# EAGLE schematic FPGA_APU V3 (EAGLE 9.6.2)
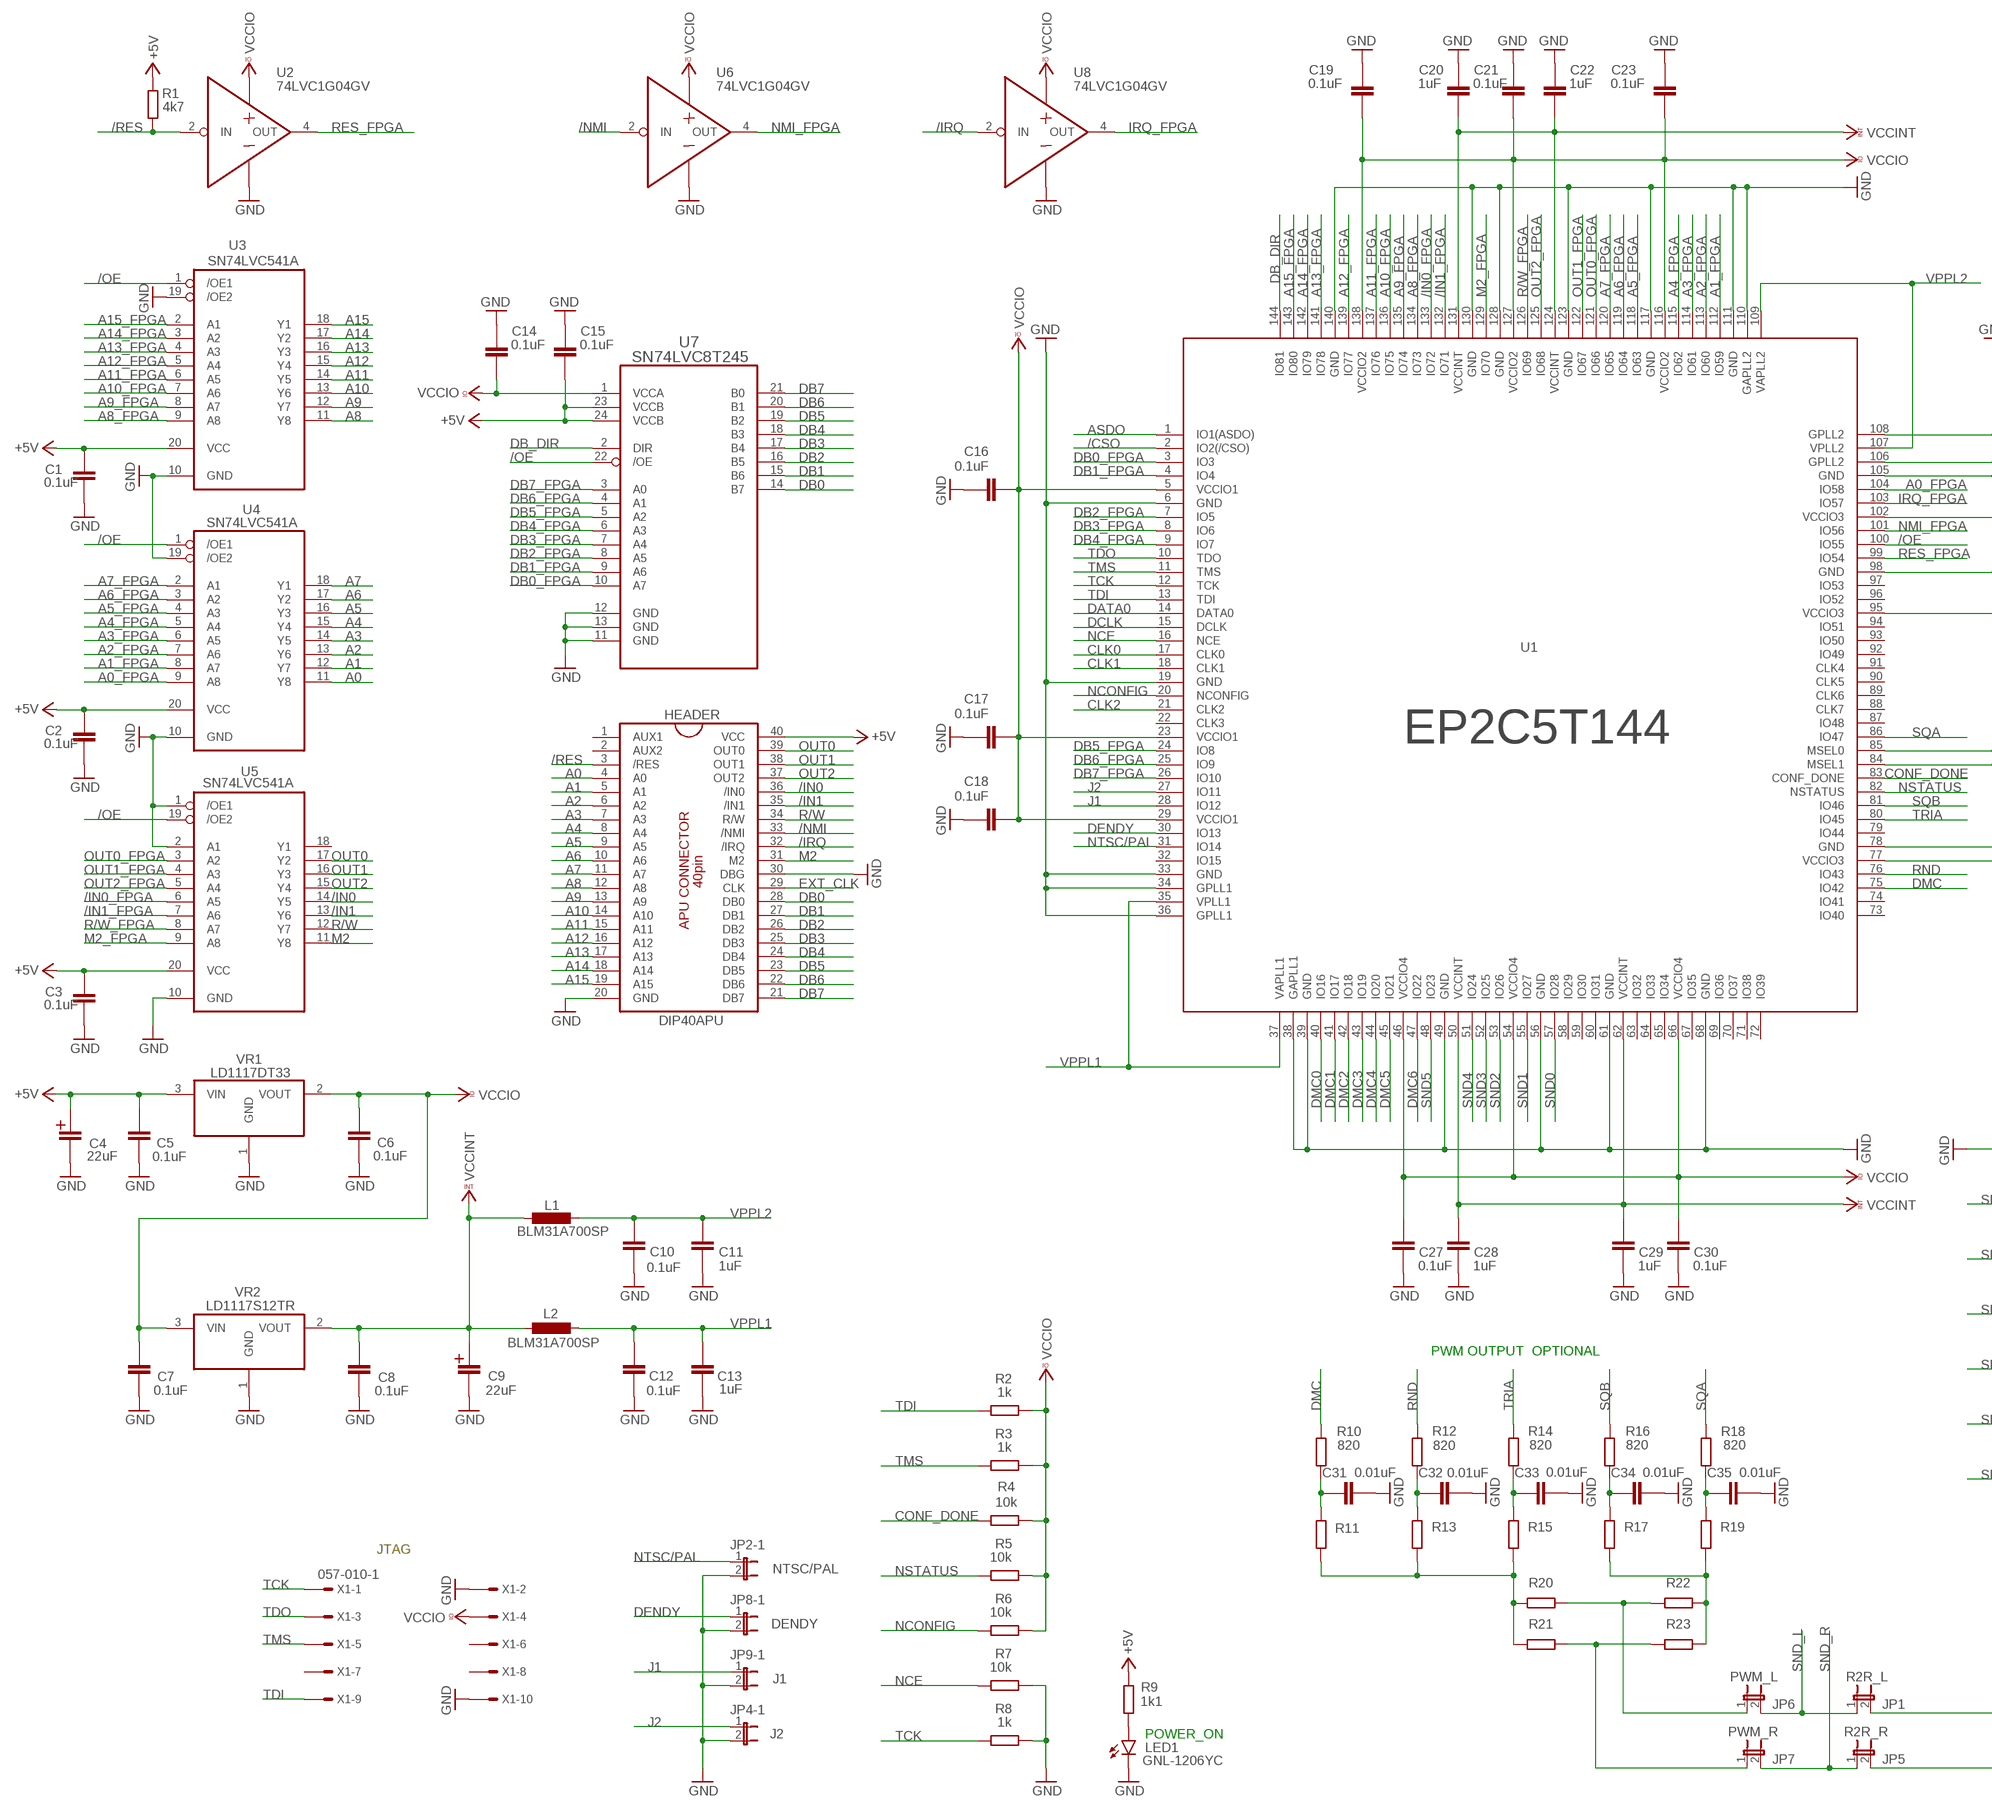
[diagram p0: schematic, sheet 1, part 1 of 2]
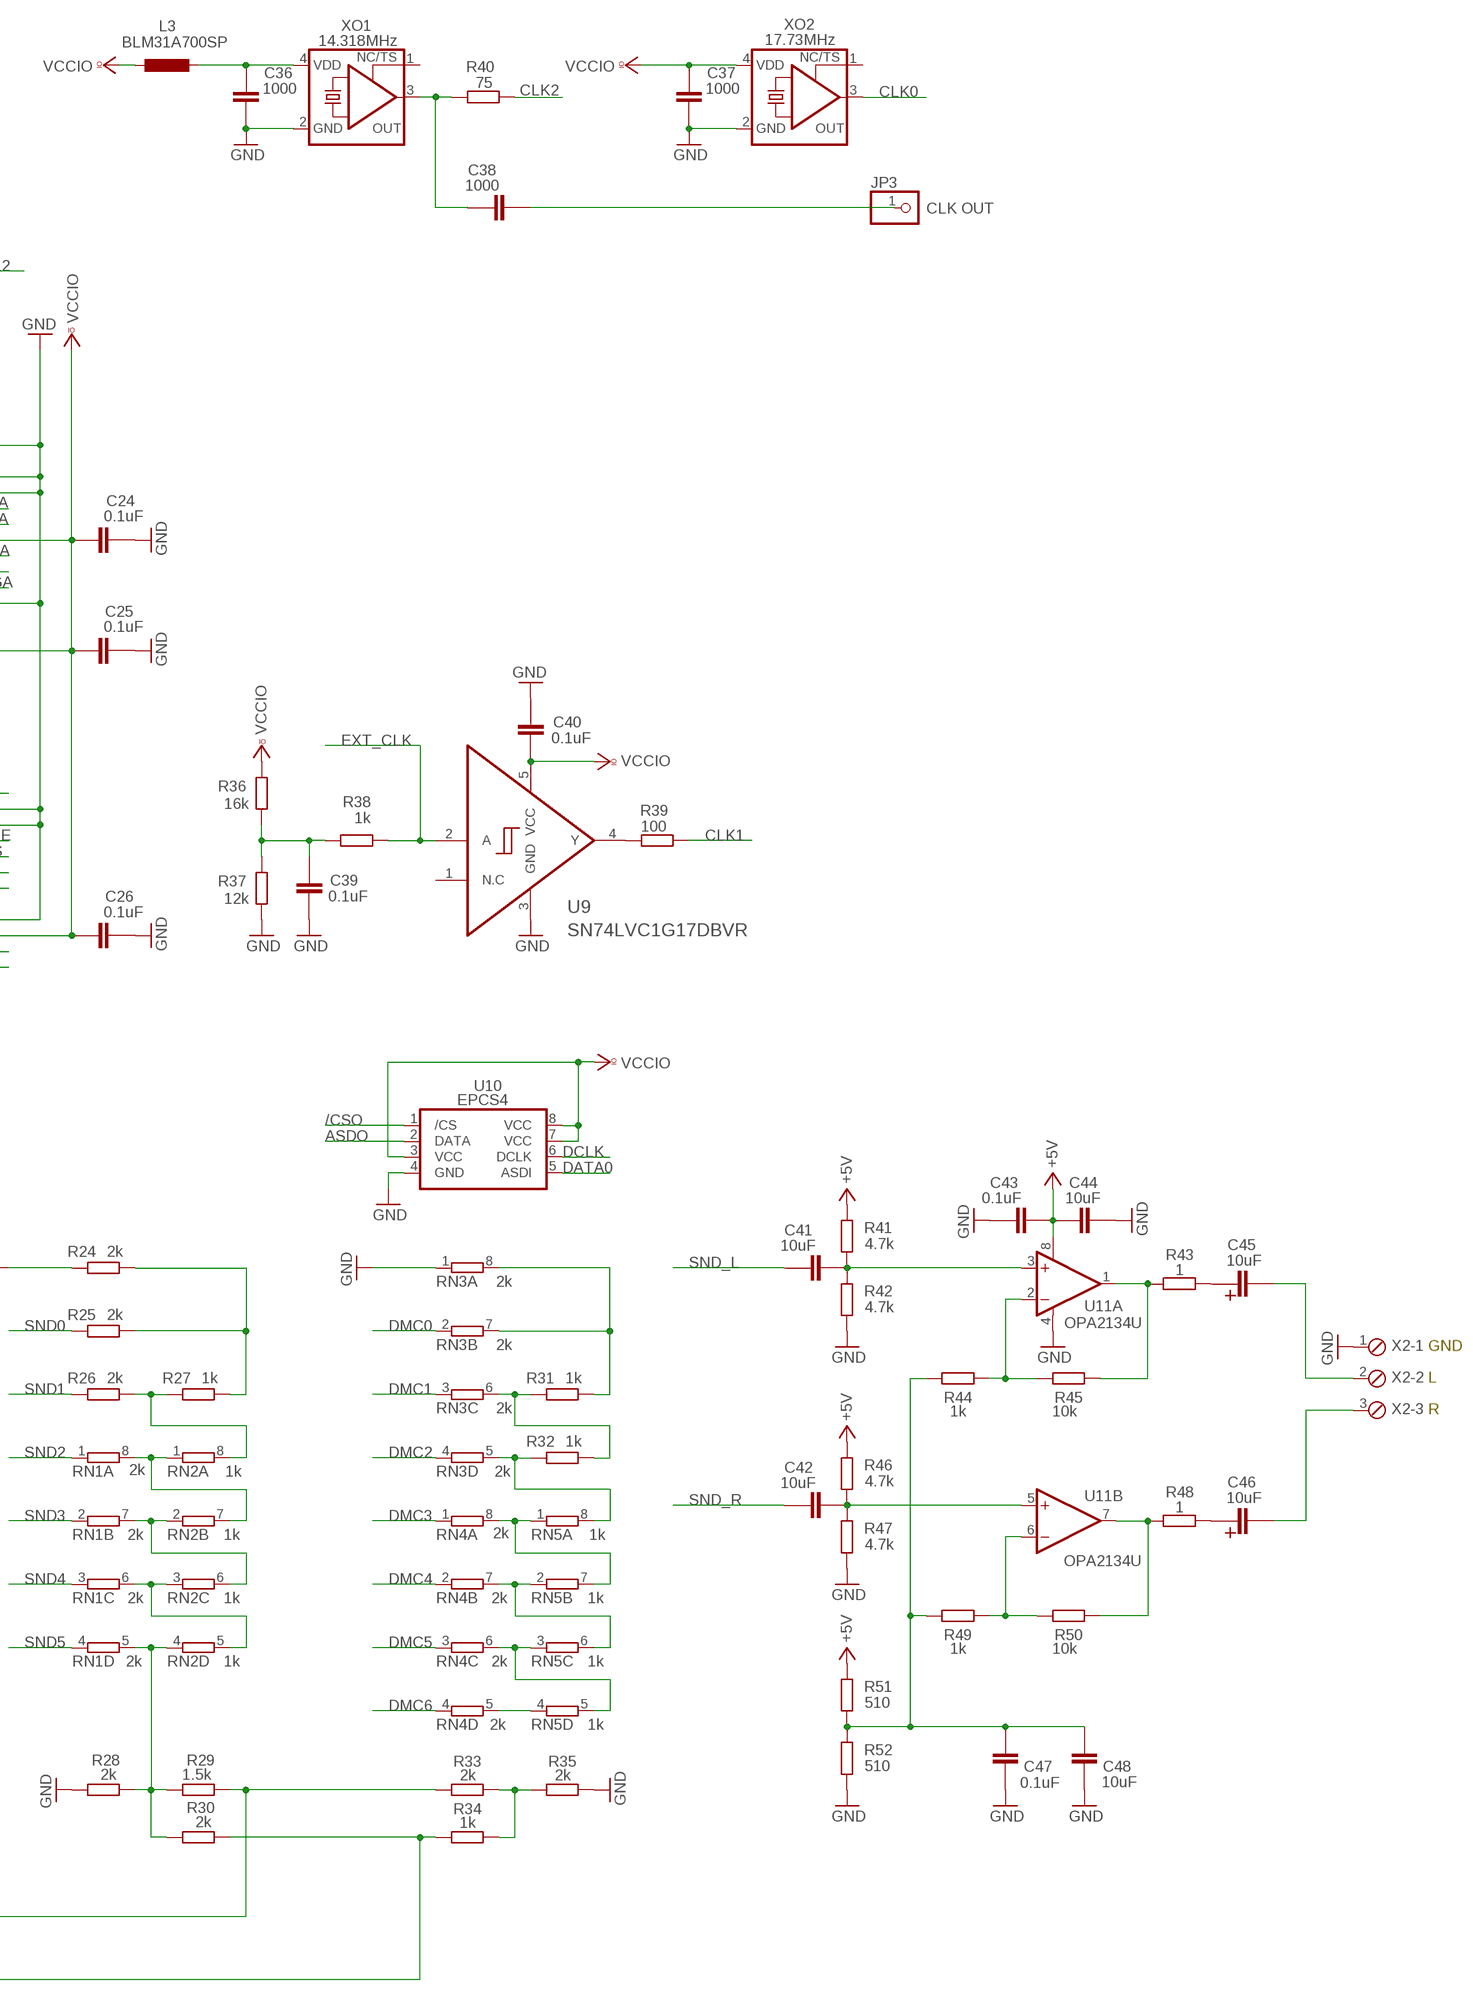
[diagram p1: schematic, sheet 1, part 2 of 2]

## Parts
C1  0.1uF  C-EUC0805  [C0805]
C2  0.1uF  C-EUC0805  [C0805]
C3  0.1uF  C-EUC0805  [C0805]
C4  22uF  CPOL-EU153CLV-0505  [153CLV-0505]
C5  0.1uF  C-EUC0805  [C0805]
C6  0.1uF  C-EUC0805  [C0805]
C7  0.1uF  C-EUC0805  [C0805]
C8  0.1uF  C-EUC0805  [C0805]
C9  22uF  CPOL-EU153CLV-0505  [153CLV-0505]
C10  0.1uF  C-EUC0805  [C0805]
C11  1uF  C-EUC0805  [C0805]
C12  0.1uF  C-EUC0805  [C0805]
C13  1uF  C-EUC0805  [C0805]
C14  0.1uF  C-EUC0805  [C0805]
C15  0.1uF  C-EUC0805  [C0805]
C16  0.1uF  C-EUC0805  [C0805]
C17  0.1uF  C-EUC0805  [C0805]
C18  0.1uF  C-EUC0805  [C0805]
C19  0.1uF  C-EUC0805  [C0805]
C20  1uF  C-EUC0805  [C0805]
C21  0.1uF  C-EUC0805  [C0805]
C22  1uF  C-EUC0805  [C0805]
C23  0.1uF  C-EUC0805  [C0805]
C24  0.1uF  C-EUC0805  [C0805]
C25  0.1uF  C-EUC0805  [C0805]
C26  0.1uF  C-EUC0805  [C0805]
C27  0.1uF  C-EUC0805  [C0805]
C28  1uF  C-EUC0805  [C0805]
C29  1uF  C-EUC0805  [C0805]
C30  0.1uF  C-EUC0805  [C0805]
C31  0.01uF  C-EUC0805  [C0805]
C32  0.01uF  C-EUC0805  [C0805]
C33  0.01uF  C-EUC0805  [C0805]
C34  0.01uF  C-EUC0805  [C0805]
C35  0.01uF  C-EUC0805  [C0805]
C36  1000  C-EUC0805  [C0805]
C37  1000  C-EUC0805  [C0805]
C38  1000  C-EUC0805  [C0805]
C39  0.1uF  C-EUC0603  [C0603]
C40  0.1uF  C-EUC0603  [C0603]
C41  10uF  C-EUC0805  [C0805]
C42  10uF  C-EUC0805  [C0805]
C43  0.1uF  C-EUC0805  [C0805]
C44  10uF  C-EUC0805  [C0805]
C45  10uF  CPOL-EU153CLV-0505  [153CLV-0505]
C46  10uF  CPOL-EU153CLV-0505  [153CLV-0505]
C47  0.1uF  C-EUC0805  [C0805]
C48  10uF  C-EUC0805  [C0805]
HEADER  DIP40APU  [DIP-40]
JP1  R2R_L  JP1E  [JP1]
JP2  NTSC/PAL  JP4QE  [JP4Q]
JP3  CLK OUT  PINHD-1X1  [1X01]
JP4  J2  JP4QE  [JP4Q]
JP5  R2R_R  JP1E  [JP1]
JP6  PWM_L  JP1E  [JP1]
JP7  PWM_R  JP1E  [JP1]
JP8  DENDY  JP4QE  [JP4Q]
JP9  J1  JP4QE  [JP4Q]
L1  BLM31A700SP  L-EUL2012C  [L2012C]
L2  BLM31A700SP  L-EUL2012C  [L2012C]
L3  BLM31A700SP  L-EUL2012C  [L2012C]
LED1  GNL-1206YC  LED  [SMARTLED-TTW]
R1  4k7  R-EU_R0805  [R0805]
R2  1k  R-EU_R0805  [R0805]
R3  1k  R-EU_R0805  [R0805]
R4  10k  R-EU_R0805  [R0805]
R5  10k  R-EU_R0805  [R0805]
R6  10k  R-EU_R0805  [R0805]
R7  10k  R-EU_R0805  [R0805]
R8  1k  R-EU_R0805  [R0805]
R9  1k1  R-EU_R0805  [R0805]
R10  820  R-EU_R0805  [R0805]
R11  R-EU_R0805  [R0805]
R12  820  R-EU_R0805  [R0805]
R13  R-EU_R0805  [R0805]
R14  820  R-EU_R0805  [R0805]
R15  R-EU_R0805  [R0805]
R16  820  R-EU_R0805  [R0805]
R17  R-EU_R0805  [R0805]
R18  820  R-EU_R0805  [R0805]
R19  R-EU_R0805  [R0805]
R20  R-EU_R0805  [R0805]
R21  R-EU_R0805  [R0805]
R22  R-EU_R0805  [R0805]
R23  R-EU_R0805  [R0805]
R24  2k  R-EU_R0805  [R0805]
R25  2k  R-EU_R0805  [R0805]
R26  2k  R-EU_R0805  [R0805]
R27  1k  R-EU_R0805  [R0805]
R28  2k  R-EU_R0805  [R0805]
R29  1.5k  R-EU_R0805  [R0805]
R30  2k  R-EU_R0805  [R0805]
R31  1k  R-EU_R0805  [R0805]
R32  1k  R-EU_R0805  [R0805]
R33  2k  R-EU_R0805  [R0805]
R34  1k  R-EU_R0805  [R0805]
R35  2k  R-EU_R0805  [R0805]
R36  16k  R-EU_R0805  [R0805]
R37  12k  R-EU_R0805  [R0805]
R38  1k  R-EU_R0805  [R0805]
R39  100  R-EU_R0805  [R0805]
R40  75  R-EU_R0805  [R0805]
R41  4.7k  R-EU_R0805  [R0805]
R42  4.7k  R-EU_R0805  [R0805]
R43  1  R-EU_R0805  [R0805]
R44  1k  R-EU_R0805  [R0805]
R45  10k  R-EU_R0805  [R0805]
R46  4.7k  R-EU_R0805  [R0805]
R47  4.7k  R-EU_R0805  [R0805]
R48  1  R-EU_R0805  [R0805]
R49  1k  R-EU_R0805  [R0805]
R50  10k  R-EU_R0805  [R0805]
R51  510  R-EU_R0805  [R0805]
R52  510  R-EU_R0805  [R0805]
RN1  2k  4R-N0603-ARC  [0603-ARC]
RN2  1k  4R-N0603-ARC  [0603-ARC]
RN3  2k  4R-N0603-ARC  [0603-ARC]
RN4  2k  4R-N0603-ARC  [0603-ARC]
RN5  1k  4R-N0603-ARC  [0603-ARC]
U1  EP2C5T144  [TQFP144]
U2  74LVC1G04GV  [SOT95P275X110-5N]
U3  SN74LVC541A  [TSOP20]
U4  SN74LVC541A  [TSOP20]
U5  SN74LVC541A  [TSOP20]
U6  74LVC1G04GV  [SOT95P275X110-5N]
U7  SN74LVC8T245  [SOP65P640X110-24N]
U8  74LVC1G04GV  [SOT95P275X110-5N]
U9  SN74LVC1G17DBVR  [SOT95P280X145-5N]
U10  EPCS4  [SO08]
U11  OPA2134U  [SO08]
VR1  LD1117DT33  [DPAK456P1010X240-3N]
VR2  LD1117S12TR  [SOT-223-3]
X1  057-010-1  [057-010-1]
X2  OUT  MPT7  [7POL254]
XO1  14.318MHz  KXO-PXO/XO-V97  [7.0X5.08_KXO-(V)97]
XO2  17.73MHz  KXO-PXO/XO-V95  [2.5X2.0_KXO-V95]

## Nets
+5V: C1.1 C2.1 C3.1 C4.+ C5.1 C15.2 C43.2 C44.1 HEADER.40(VCC) R1.1 R9.2 R41.1 R46.1 R51.1 U3.20(VCC) U4.20(VCC) U5.20(VCC) U7.23(VCCB) U7.24(VCCB) U11.8(A:V+) VR1.3(VIN)
/CSO: U1.2(IO2(/CSO)) U10.1(/CS)
/IN0: HEADER.36(/IN0) U5.14(Y5)
/IN0_FPGA: U1.133(IO72) U5.6(A5)
/IN1: HEADER.35(/IN1) U5.13(Y6)
/IN1_FPGA: U1.132(IO71) U5.7(A6)
/IRQ: HEADER.32(/IRQ) U8.2(IN)
/NMI: HEADER.33(/NMI) U6.2(IN)
/OE: U1.100(IO55) U3.1(/OE1) U4.1(/OE1) U5.19(/OE2) U7.22(/OE)
/RES: HEADER.3(/RES) R1.2 U2.2(IN)
A0: HEADER.4(A0) U4.11(Y8)
A0_FPGA: U1.104(IO58) U4.9(A8)
A1: HEADER.5(A1) U4.12(Y7)
A1_FPGA: U1.112(IO59) U4.8(A7)
A2: HEADER.6(A2) U4.13(Y6)
A2_FPGA: U1.113(IO60) U4.7(A6)
A3: HEADER.7(A3) U4.14(Y5)
A3_FPGA: U1.114(IO61) U4.6(A5)
A4: HEADER.8(A4) U4.15(Y4)
A4_FPGA: U1.115(IO62) U4.5(A4)
A5: HEADER.9(A5) U4.16(Y3)
A5_FPGA: U1.118(IO63) U4.4(A3)
A6: HEADER.10(A6) U4.17(Y2)
A6_FPGA: U1.119(IO64) U4.3(A2)
A7: HEADER.11(A7) U4.18(Y1)
A7_FPGA: U1.120(IO65) U4.2(A1)
A8: HEADER.12(A8) U3.11(Y8)
A8_FPGA: U1.134(IO73) U3.9(A8)
A9: HEADER.13(A9) U3.12(Y7)
A9_FPGA: U1.135(IO74) U3.8(A7)
A10: HEADER.14(A10) U3.13(Y6)
A10_FPGA: U1.136(IO75) U3.7(A6)
A11: HEADER.15(A11) U3.14(Y5)
A11_FPGA: U1.137(IO76) U3.6(A5)
A12: HEADER.16(A12) U3.15(Y4)
A12_FPGA: U1.139(IO77) U3.5(A4)
A13: HEADER.17(A13) U3.16(Y3)
A13_FPGA: U1.141(IO78) U3.4(A3)
A14: HEADER.18(A14) U3.17(Y2)
A14_FPGA: U1.142(IO79) U3.3(A2)
A15: HEADER.19(A15) U3.18(Y1)
A15_FPGA: U1.143(IO80) U3.2(A1)
ASDO: U1.1(IO1(ASDO)) U10.2(DATA)
CLK0: U1.17(CLK0) XO2.3(OUT)
CLK1: R39.2 U1.18(CLK1)
CLK2: R40.2 U1.21(CLK2)
CONF_DONE: R4.2 U1.83(CONF_DONE)
DATA0: U1.14(DATA0) U10.5(ASDI)
DB0: HEADER.28(DB0) U7.14(B7)
DB0_FPGA: U1.3(IO3) U7.10(A7)
DB1: HEADER.27(DB1) U7.15(B6)
DB1_FPGA: U1.4(IO4) U7.9(A6)
DB2: HEADER.26(DB2) U7.16(B5)
DB2_FPGA: U1.7(IO5) U7.8(A5)
DB3: HEADER.25(DB3) U7.17(B4)
DB3_FPGA: U1.8(IO6) U7.7(A4)
DB4: HEADER.24(DB4) U7.18(B3)
DB4_FPGA: U1.9(IO7) U7.6(A3)
DB5: HEADER.23(DB5) U7.19(B2)
DB5_FPGA: U1.24(IO8) U7.5(A2)
DB6: HEADER.22(DB6) U7.20(B1)
DB6_FPGA: U1.25(IO9) U7.4(A1)
DB7: HEADER.21(DB7) U7.21(B0)
DB7_FPGA: U1.26(IO10) U7.3(A0)
DB_DIR: U1.144(IO81) U7.2(DIR)
DCLK: U1.15(DCLK) U10.6(DCLK)
DENDY: JP8.1 U1.30(IO13)
DMC: R10.1 U1.75(IO42)
DMC0: RN3.2 U1.40(IO16)
DMC1: RN3.3 U1.41(IO17)
DMC2: RN3.4 U1.42(IO18)
DMC3: RN4.1 U1.43(IO19)
DMC4: RN4.2 U1.44(IO20)
DMC5: RN4.3 U1.45(IO21)
DMC6: RN4.4 U1.47(IO22)
EXT_CLK: HEADER.29(CLK) R38.1 U9.2(A)
GND: C1.2 C2.2 C3.2 C4.- C5.2 C6.2 C7.2 C8.2 C9.- C10.2 C11.2 C12.2 C13.2 C14.1 C15.1 C16.1 C17.1 C18.1 C19.1 C20.1 C21.1 C22.1 C23.1 C24.2 C25.2 C26.2 C27.2 C28.2 C29.2 C30.2 C31.2 C32.2 C33.2 C34.2 C35.2 C36.2 C37.2 C39.1 C40.2 C43.1 C44.2 C47.2 C48.2 HEADER.20(GND) HEADER.30(DBG) JP2.2 JP4.2 JP8.2 JP9.2 LED1.C@1(C) R7.2 R8.2 R24.1 R28.1 R35.2 R37.1 R42.2 R47.2 R52.2 RN3.1 U1.6(GND) U1.19(GND) U1.33(GND) U1.34(GPLL1) U1.36(GPLL1) U1.38(GAPLL1) U1.39(GND) U1.49(GND) U1.56(GND) U1.61(GND) U1.68(GND) U1.78(GND) U1.84(MSEL1) U1.85(MSEL0) U1.98(GND) U1.105(GND) U1.106(GPLL2) U1.108(GPLL2) U1.110(GAPLL2) U1.111(GND) U1.117(GND) U1.123(GND) U1.128(GND) U1.130(GND) U1.140(GND) U2.3(GND) U3.10(GND) U3.19(/OE2) U4.10(GND) U4.19(/OE2) U5.1(/OE1) U5.2(A1) U5.10(GND) U6.3(GND) U7.11(GND) U7.12(GND) U7.13(GND) U8.3(GND) U9.3(GND) U10.4(GND) U11.4(A:V-) VR1.1(GND) VR2.1(GND) X1.2 X1.10 X2.1 XO1.2(GND) XO2.2(GND)
IRQ_FPGA: U1.103(IO57) U8.4(OUT)
J1: JP9.1 U1.28(IO12)
J2: JP4.1 U1.27(IO11)
M2: HEADER.31(M2) U5.11(Y8)
M2_FPGA: U1.129(IO70) U5.9(A8)
N$1: RN4.5 RN5.4
N$2: C38.2 JP3.1
N$3: R28.2 R29.1 R30.1 RN1.5 RN2.4
N$4: C45.- X2.2
N$5: LED1.A@1(A) R9.1
N$6: C38.1 R40.1 XO1.3(OUT)
N$8: R49.2 R50.1 U11.6(B:-IN)
N$11: C46.- X2.3
N$17: RN1.8 RN2.1 RN2.7
N$18: R26.2 R27.1 RN2.8
N$19: R33.2 R34.2 R35.1
N$23: RN1.7 RN2.2 RN2.6
N$24: C36.1 L3.2 XO1.4(VDD)
N$25: RN1.6 RN2.3 RN2.5
N$27: R24.2 R25.2 R27.2
N$28: JP1.2 R29.2 R33.1
N$29: JP5.2 R30.2 R34.1
N$32: C31.1 R10.2 R11.1
N$33: R11.2 R13.2 R15.2 R20.1 R21.1
N$34: C32.1 R12.2 R13.1
N$35: R17.2 R19.2 R22.2 R23.2
N$36: C33.1 R14.2 R15.1
N$37: C45.+ R43.2
N$38: C34.1 R16.2 R17.1
N$39: JP6.1 R20.2 R22.1
N$40: C35.1 R18.2 R19.1
N$41: JP7.1 R21.2 R23.1
N$42: R44.2 R45.1 U11.2(A:-IN)
N$43: R43.1 R45.2 U11.1(A:OUT)
N$44: R48.1 R50.2 U11.7(B:OUT)
N$46: C41.2 R41.2 R42.1 U11.3(A:+IN)
N$47: C42.2 R46.2 R47.1 U11.5(B:+IN)
N$48: C46.+ R48.2
N$49: C39.2 R36.1 R37.2 R38.2
N$50: R39.1 U9.4(Y)
N$52: RN4.8 RN5.1 RN5.7
N$53: R32.1 RN3.5 RN5.8
N$54: RN4.7 RN5.2 RN5.6
N$55: RN4.6 RN5.3 RN5.5
N$56: R31.2 RN3.7 RN3.8
N$57: R31.1 R32.2 RN3.6
NCE: R7.1 U1.16(NCE)
NCONFIG: R6.1 U1.20(NCONFIG)
NMI_FPGA: U1.101(IO56) U6.4(OUT)
NSTATUS: R5.1 U1.82(NSTATUS)
NTSC/PAL: JP2.1 U1.31(IO14)
OUT0: HEADER.39(OUT0) U5.17(Y2)
OUT0_FPGA: U1.121(IO66) U5.3(A2)
OUT1: HEADER.38(OUT1) U5.16(Y3)
OUT1_FPGA: U1.122(IO67) U5.4(A3)
OUT2: HEADER.37(OUT2) U5.15(Y4)
OUT2_FPGA: U1.125(IO68) U5.5(A4)
R/W: HEADER.34(R/W) U5.12(Y7)
R/W_FPGA: U1.126(IO69) U5.8(A7)
RES_FPGA: U1.99(IO54) U2.4(OUT)
RND: R12.1 U1.76(IO43)
SND0: R25.1 U1.57(IO28)
SND1: R26.1 U1.55(IO27)
SND2: RN1.1 U1.53(IO26)
SND3: RN1.2 U1.52(IO25)
SND4: RN1.3 U1.51(IO24)
SND5: RN1.4 U1.48(IO23)
SND_L: C41.1 JP1.1 JP6.2
SND_R: C42.1 JP5.1 JP7.2
SQA: R18.1 U1.86(IO47)
SQB: R16.1 U1.81(IO46)
TCK: R8.1 U1.12(TCK) X1.1
TDI: R2.1 U1.13(TDI) X1.9
TDO: U1.10(TDO) X1.3
TMS: R3.1 U1.11(TMS) X1.5
TRIA: R14.1 U1.80(IO45)
VCCINT: C8.1 C9.+ C20.2 C22.2 C28.1 C29.1 L1.2 L2.1 U1.50(VCCINT) U1.62(VCCINT) U1.124(VCCINT) U1.131(VCCINT) VR2.2(VOUT)
VCCIO: C6.1 C7.1 C14.2 C16.2 C17.2 C18.2 C19.2 C21.2 C23.2 C24.1 C25.1 C26.1 C27.1 C30.1 C37.1 C40.1 L3.1 R2.2 R3.2 R4.1 R5.2 R6.2 R36.2 U1.5(VCCIO1) U1.23(VCCIO1) U1.29(VCCIO1) U1.46(VCCIO4) U1.54(VCCIO4) U1.66(VCCIO4) U1.77(VCCIO3) U1.95(VCCIO3) U1.102(VCCIO3) U1.116(VCCIO2) U1.127(VCCIO2) U1.138(VCCIO2) U2.5(VCC) U6.5(VCC) U7.1(VCCA) U8.5(VCC) U9.5(VCC) U10.3(VCC) U10.7(VCC) U10.8(VCC) VR1.2(VOUT) VR2.3(VIN) X1.4 XO2.4(VDD)
VPPL1: C12.1 C13.1 L2.2 U1.35(VPLL1) U1.37(VAPLL1)
VPPL2: C10.1 C11.1 L1.1 U1.107(VPLL2) U1.109(VAPLL2)
VPPL3: C47.1 C48.1 R44.1 R49.1 R51.2 R52.1
Unconnected: HEADER.1(AUX1) HEADER.2(AUX2) JP2.3 JP2.4 JP2.5 JP2.6 JP2.7 JP2.8 JP4.3 JP4.4 JP4.5 JP4.6 JP4.7 JP4.8 JP8.3 JP8.4 JP8.5 JP8.6 JP8.7 JP8.8 JP9.3 JP9.4 JP9.5 JP9.6 JP9.7 JP9.8 U1.22(CLK3) U1.32(IO15) U1.58(IO29) U1.59(IO30) U1.60(IO31) U1.63(IO32) U1.64(IO33) U1.65(IO34) U1.67(IO35) U1.69(IO36) U1.70(IO37) U1.71(IO38) U1.72(IO39) U1.73(IO40) U1.74(IO41) U1.79(IO44) U1.87(IO48) U1.88(CLK7) U1.89(CLK6) U1.90(CLK5) U1.91(CLK4) U1.92(IO49) U1.93(IO50) U1.94(IO51) U1.96(IO52) U1.97(IO53) U5.18(Y1) U9.1(N.C) X1.6 X1.7 X1.8 X2.4 X2.5 X2.6 X2.7 XO1.1(TS) XO2.1(TS)

## Notes on the sheet
- GND
- L
- R
- PWM OUTPUT  OPTIONAL
- JTAG
- POWER_ON

## Library data of the parts
C1-C3 C5-C8 C10-C44 C47 C48 = rcl_my:C-EU: CAPACITOR, European symbol; SPICEPREFIX: C
C4 C9 C45 C46 = rcl_my:CPOL-EU: POLARIZED CAPACITOR, European symbol; SPICEPREFIX: C
HEADER = SnapEDA-Library:DIP40APU
JP1 JP5-JP7 = jumper:JP1E: JUMPER
JP2 JP4 JP8 JP9 = jumper:JP4QE: JUMPER
JP3 = pinhead:PINHD-1X1: PIN HEADER
L1-L3 = rcl:L-EU: INDUCTOR, European symbol; SPICEPREFIX: L
LED1 = led:LED: LED OSRAM: - CHIPLED LG R971, LG N971, LY N971, LG Q971, LY Q971, LO R971, LY R971 LH N974, LH R974 LS Q976, LO Q976, LY Q976 LO Q996 - Hyper CHIPLED LW Q18S LB Q993, LB Q99A, LB R99A - SideLED LS A670, LO A670, LY A670, LG A670, LP A670 LB A673, LV A673, LT A673, LW A673 LH A674 LY A675 LS A676, LA A676, LO A676, LY A676, LW A676 LS A679, LY A679, LG A679 - Hyper Micro SIDELED® LS Y876, LA Y876, LO Y876, LY Y876 LT Y87S - SmartLED LW L88C, LW L88S LB L89C, LB L89S, LG L890 LS L89K, LO L89K, LY L89K LS L896, LA L896, LO L896, LY L896 - TOPLED LS T670, LO T670, LY T670, LG T670, LP T670 LSG T670, LSP T670, LSY T670, LOP T670, LYG T670 LG T671, LOG T671, LSG T671 LB T673, LV T673, LT T673, LW T673 LH T674 LS T676, LA T676, LO T676, LY T676, LB T676, LH T676, LSB T676, LW T676 LB T67C, LV T67C, LT T67C, LS T67K, LO T67K, LY T67K, LW E67C LS E67B, LA E67B, LO E67B, LY E67B, LB E67C, LV E67C, LT E67C LW T67C LS T679, LY T679, LG T679 LS T770, LO T770, LY T770, LG T770, LP T770 LB T773, LV T773, LT T773, LW T773 LH T774 LS E675, LA E675, LY E675, LS T675 LS T776, LA T776, LO T776, LY T776, LB T776 LHGB T686 LT T68C, LB T68C - Hyper Mini TOPLED® LB M676 - Mini TOPLED Santana® LG M470 LS M47K, LO M47K, LY M47K Source: http://www.osram.convergy.de LUXEON: - LUMILED® LXK2-PW12-R00, LXK2-PW12-S00, LXK2-PW14-U00, LXK2-PW14-V00 LXK2-PM12-R00, LXK2-PM12-S00, LXK2-PM14-U00 LXK2-PE12-Q00, LXK2-PE12-R00, LXK2-PE12-S00, LXK2-PE14-T00, LXK2-PE14-U00 LXK2-PB12-K00, LXK2-PB12-L00, LXK2-PB12-M00, LXK2-PB14-N00, LXK2-PB14-P00, LXK2-PB14-Q00 LXK2-PR12-L00, LXK2-PR12-M00, LXK2-PR14-Q00, LXK2-PR14-R00 LXK2-PD12-Q00, LXK2-PD12-R00, LXK2-PD12-S00 LXK2-PH12-R00, LXK2-PH12-S00 LXK2-PL12-P00, LXK2-PL12-Q00, LXK2-PL12-R00 Source: www.luxeon.com KINGBRIGHT: KA-3528ASYC Source: www.kingbright.com
R1-R52 = rcl:R-EU_: RESISTOR, European symbol; SPICEPREFIX: R
RN1-RN5 = resistor-dil:4R-N: Array Chip Resistor Source: RS Component / Phycomp; OC_FARNELL: unknown; OC_NEWARK: unknown
U1 = EP2C5T144:EP2C5T144: EP2C5T144 Auto generated by make-symbol-device-package-bsdl.ulp Rev. 19 Tip: Use split-device-symbol.ulp to generate a Device with multiple small symbols! Read HELP. Source: EP2C5T144.BSD; MPN: EP2C5T144C8N; OC_FARNELL: 1453495; OC_NEWARK: 51R0568
U2 U6 U8 = 74LVC1G04GV:74LVC1G04GV
U3-U5 = SnapEDA-Library:SN74LVC541A; PACKAGE: TSSOP-20; SUPPLIER: TI
U7 = SnapEDA-Library:SN74LVC8T245
U9 = SN74LVC1G17DBVR:SN74LVC1G17DBVR
U10 = EPCS4:EPCS4
U11 = burr-brown:OPA2134: Operational Amplifier; MF: TEXAS INSTRUMENTS; MPN: OPA2134UA; OC_FARNELL: 1206935; OC_NEWARK: 35C1847
VR1 = LD1117DT33:LD1117DT33; MANUFACTURER: STMicroelectronics; PARTREV: 33; STANDARD: IPC7351B
VR2 = LD1117S12TR:LD1117S12TR
X1 = con-panduit:057-010-: CONNECTOR 10-pin series 057 contact pc board low profile headers; OC_FARNELL: unknown; OC_NEWARK: unknown
X2 = con-phoenix-254:MPT7: PHOENIX CONNECTOR; OC_FARNELL: unknown; OC_NEWARK: unknown
XO1 XO2 = crystal-geyer_V1_0:KXO-PXO/XO-V: Clock Oscillator (PXO/XO) MHz : KXO-V - Serie Model Size l/w/h [mm] Frequency Range Frequency Stability Temp. Range [°C] Output AECQ 200 availabel Datasheet KXO-V94 KXO-V94 KXO-V95 KXO-V95 KXO-V96 KXO-V96 KXO-V99 KXO-V99 KXO-97 KXO-V97 KXO-97 - KXO-V97 2.0/1.6/0.80 2.0/1.6/0.80 2.5/2.0/0.82 2.5/2.0/0.82 3.2/2.5/1.2 3.2/2.5/1.2 5.0/3.2/1.2 5.0/3.2/1.2 7.0/5.08/1.3 7.0/5.08/1.3 7.0/5.08/1.3 32,768 kHz 1,0 ~ 80,0 MHz 32,768 kHz 1,0 ~ 70,0 MHz 32,768 kHz 1,0 ~ 156,0 MHz 32,768 kHz 1,0 ~ 200,0 MHz 32,768 kHz 32,768 kHz 1,0 ~ 160,0 MHz ±25 … ±100ppm ±25 … ±100ppm ±25 … ±100ppm ±25 … ±100ppm ±25 … ±100ppm ±25 … ±100ppm ±25 … ±100ppm ±25 … ±100ppm ±25 … ±100ppm ±25 … ±100ppm ±25 … ±100ppm (*) -40°C …+85°C (*) -40°C …+85°C (*) -40°C …+85°C (*) -40°C …+85°C (*) -40°C …+85°C (*) -40°C …+85°C (*) -40°C …+85°C (*) -40°C …+85°C (*) -40°C …+85°C (*) -40°C …+85°C (*) -40°C …+85°C HCMOS HCMOS HCMOS HCMOS HCMOS HCMOS HCMOS HCMOS HCMOS HCMOS HCMOS - - yes yes yes yes - - - - - KXO-V94-kHz.pdf <http://www.geyer-electronic.de/uploads/tx_userartikelfrequenz/GEYER-KXO-V94-kHz.pdf> KXO-V94.pdf <http://www.geyer-electronic.de/uploads/tx_userartikelfrequenz/GEYER-KXO-V94.pdf> KXO-V95-kHz.pdf <http://www.geyer-electronic.de/uploads/tx_userartikelfrequenz/GEYER-KXO-V95-kHz.pdf> KXO-V95.pdf <http://www.geyer-electronic.de/uploads/tx_userartikelfrequenz/GEYER-KXO-V95.pdf> KXO-V96-kHz.pdf <http://www.geyer-electronic.de/uploads/tx_userartikelfrequenz/GEYER-KXO-V96-kHz.pdf> KXO-V96.pdf <http://www.geyer-electronic.de/uploads/tx_userartikelfrequenz/GEYER-KXO-V96.pdf> KXO-V99-kHz.pdf <http://www.geyer-electronic.de/uploads/tx_userartikelfrequenz/GEYER-KXO-V99-kHz.pdf> KXO-V99.pdf <http://www.geyer-electronic.de/uploads/tx_userartikelfrequenz/GEYER-KXO-V99.pdf> KXO-97-kHz.pdf <http://www.geyer-electronic.de/uploads/tx_userartikelfrequenz/GEYER-KXO-97-kHz.pdf> KXO-V97-kHz.pdf <http://www.geyer-electronic.de/uploads/tx_userartikelfrequenz/GEYER-KXO-V97-kHz.pdf> KXO-V97.pdf <http://www.geyer-electronic.de/uploads/tx_userartikelfrequenz/GEYER-KXO-V97.pdf> <http://www.geyer-electronic.de/fileadmin/template/img/logo-geyer-electronic.png> Details see: http://www.geyer-electronic.de/Frequenz-Produkte.9.0.html Created 2016-06-07, Hans Locher 2016 (C) Geyer Quartz Technology Hans Locher KXOV94,KXOV95;KXOV96;KXOV97;KXO97;2016;2520;3225;5032;70508;2,5x2,0;3,2x2,5;5,0x3,2;7,0x5,08;2.5x2.0;3.2x2.5;5.0x3.2;7.0x5.08;